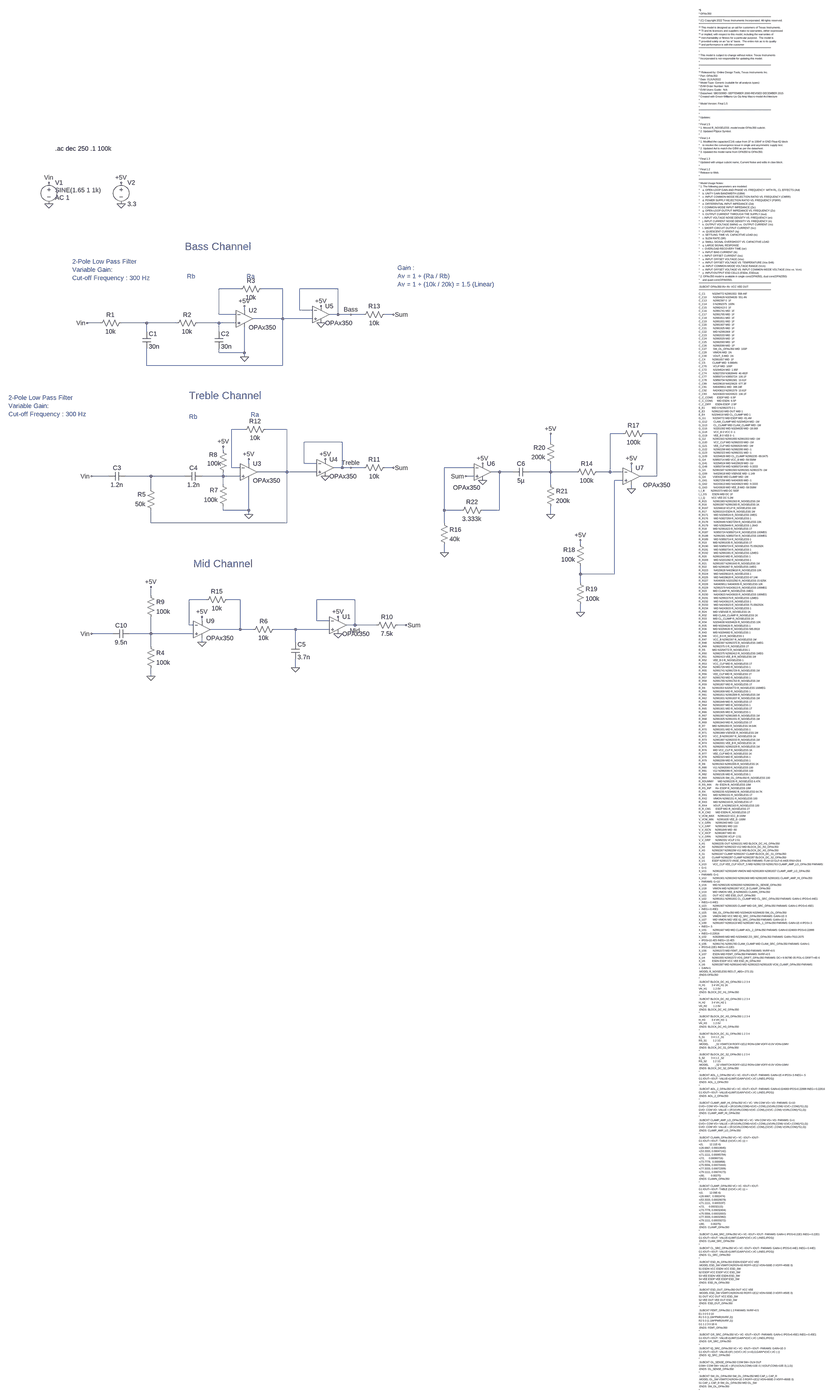
[diagram p0: schematic Filters.asc, whole sheet]
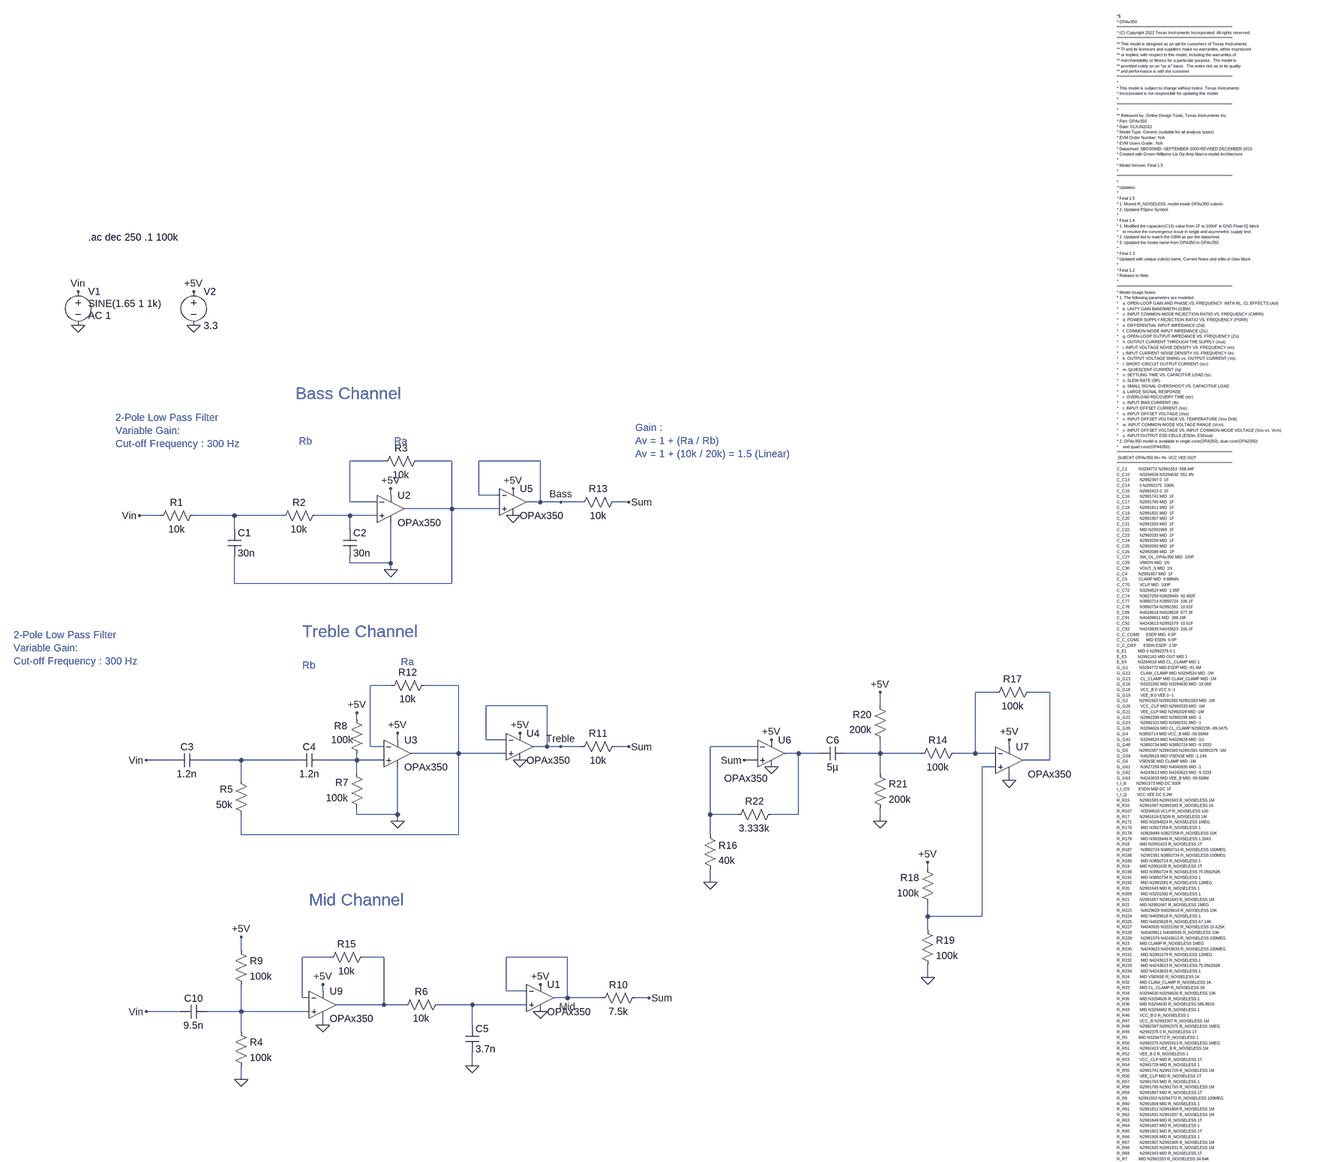
[diagram p1: schematic Filters.asc, part, row 1 of 2, column 1 of 1]
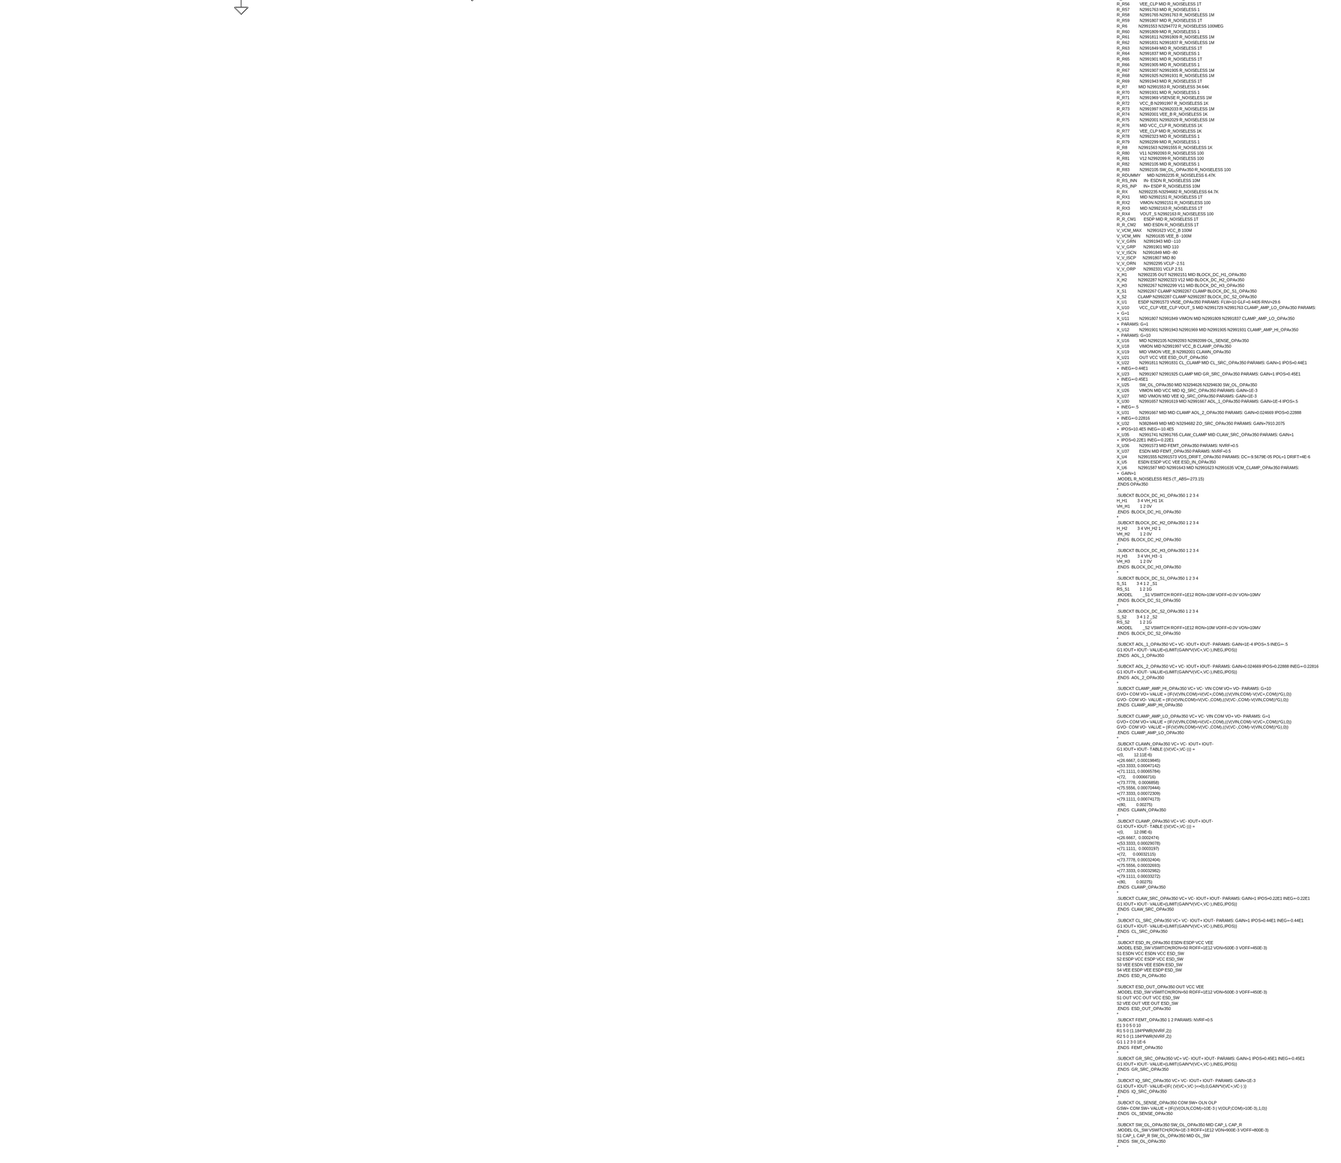
[diagram p2: schematic Filters.asc, part, row 2 of 2, column 1 of 1]
Filters.asc, the LTspice schematic file:
Version 4
SHEET 1 7924 4152
WIRE -640 -528 -720 -528
WIRE -480 -528 -560 -528
WIRE -272 -528 -416 -528
WIRE -624 -448 -624 -464
WIRE -416 -448 -416 -528
WIRE -368 -448 -416 -448
WIRE -720 -432 -720 -528
WIRE -656 -432 -720 -432
WIRE -272 -432 -272 -528
WIRE -272 -432 -304 -432
WIRE -224 -432 -272 -432
WIRE -176 -432 -224 -432
WIRE -64 -432 -96 -432
WIRE -480 -416 -480 -528
WIRE -480 -416 -592 -416
WIRE -368 -416 -480 -416
WIRE -1168 -400 -1216 -400
WIRE -992 -400 -1088 -400
WIRE -880 -400 -992 -400
WIRE -720 -400 -800 -400
WIRE -656 -400 -720 -400
WIRE -992 -368 -992 -400
WIRE -720 -368 -720 -400
WIRE -720 -288 -720 -304
WIRE -624 -288 -624 -384
WIRE -624 -288 -720 -288
WIRE -624 -272 -624 -288
WIRE -992 -240 -992 -304
WIRE -480 -240 -480 -416
WIRE -480 -240 -992 -240
WIRE -624 0 -672 0
WIRE -464 0 -544 0
WIRE 800 16 752 16
WIRE 928 16 880 16
WIRE -256 48 -400 48
WIRE 528 48 528 16
WIRE -704 80 -704 64
WIRE -608 128 -608 112
WIRE -400 128 -400 48
WIRE -352 128 -400 128
WIRE -672 144 -672 0
WIRE -640 144 -672 144
WIRE -256 144 -256 48
WIRE -256 144 -288 144
WIRE -224 144 -256 144
WIRE -176 144 -224 144
WIRE -64 144 -96 144
WIRE 240 144 128 144
WIRE 832 144 832 128
WIRE -464 160 -464 0
WIRE -464 160 -576 160
WIRE -352 160 -464 160
WIRE 336 160 304 160
WIRE 384 160 336 160
WIRE 528 160 528 128
WIRE 528 160 448 160
WIRE 624 160 528 160
WIRE 752 160 752 16
WIRE 752 160 704 160
WIRE 800 160 752 160
WIRE -1136 176 -1200 176
WIRE -976 176 -1072 176
WIRE -848 176 -976 176
WIRE -704 176 -704 160
WIRE -704 176 -784 176
WIRE -640 176 -704 176
WIRE 240 176 208 176
WIRE 928 176 928 16
WIRE 928 176 864 176
WIRE 800 192 768 192
WIRE -704 208 -704 176
WIRE 528 208 528 160
WIRE -976 224 -976 176
WIRE 832 224 832 208
WIRE -704 304 -704 288
WIRE -608 304 -608 192
WIRE -608 304 -704 304
WIRE 128 304 128 144
WIRE 192 304 128 304
WIRE 336 304 336 160
WIRE 336 304 272 304
WIRE -608 320 -608 304
WIRE 528 320 528 288
WIRE -976 352 -976 304
WIRE -464 352 -464 160
WIRE -464 352 -976 352
WIRE 128 352 128 304
WIRE 640 432 640 416
WIRE 128 464 128 432
WIRE 640 544 640 512
WIRE 768 544 768 192
WIRE 768 544 640 544
WIRE 640 576 640 544
WIRE -976 624 -976 592
WIRE -768 640 -832 640
WIRE -640 640 -688 640
WIRE -208 640 -352 640
WIRE 640 688 640 656
WIRE -784 720 -784 704
WIRE -352 720 -352 640
WIRE -304 720 -352 720
WIRE -832 736 -832 640
WIRE -816 736 -832 736
WIRE -208 736 -208 640
WIRE -208 736 -240 736
WIRE -128 736 -208 736
WIRE -16 736 -48 736
WIRE -640 752 -640 640
WIRE -640 752 -752 752
WIRE -592 752 -640 752
WIRE -432 752 -512 752
WIRE -304 752 -432 752
WIRE -1120 768 -1200 768
WIRE -976 768 -976 704
WIRE -976 768 -1056 768
WIRE -816 768 -976 768
WIRE -784 800 -784 784
WIRE -432 800 -432 752
WIRE -976 816 -976 768
WIRE -432 896 -432 864
WIRE -976 928 -976 896
FLAG -1360 -848 0
FLAG -1088 -848 0
FLAG -1360 -928 Vin
FLAG -1088 -928 +5V
FLAG -624 -272 0
FLAG -1216 -400 Vin
FLAG -624 -464 +5V
FLAG -608 320 0
FLAG -1200 176 Vin
FLAG -608 112 +5V
FLAG -704 64 +5V
FLAG -784 800 0
FLAG -1200 768 Vin
FLAG -784 704 +5V
FLAG -976 928 0
FLAG -432 896 0
FLAG -976 592 +5V
FLAG -272 704 +5V
FLAG -272 768 0
FLAG -320 112 +5V
FLAG -320 176 0
FLAG -336 -464 +5V
FLAG -336 -400 0
FLAG -224 -432 Bass
FLAG -224 144 Treble
FLAG -208 736 Mid
FLAG 272 128 +5V
FLAG 272 192 0
FLAG -16 736 Sum
FLAG -64 144 Sum
FLAG -64 -432 Sum
FLAG 208 176 Sum
FLAG 832 128 +5V
FLAG 832 224 0
FLAG 640 416 +5V
FLAG 640 688 0
FLAG 528 320 0
FLAG 528 16 +5V
FLAG 128 464 0
SYMBOL voltage -1360 -944 R0
WINDOW 3 24 44 Left 2
WINDOW 123 24 72 Left 2
WINDOW 39 0 0 Left 0
SYMATTR Value SINE(1.65 1 1k)
SYMATTR Value2 AC 1
SYMATTR InstName V1
SYMBOL voltage -1088 -944 R0
WINDOW 123 0 0 Left 0
WINDOW 39 0 0 Left 0
SYMATTR InstName V2
SYMATTR Value 3.3
SYMBOL OpAmps\\opamp2 -624 -480 R0
SYMATTR InstName U2
SYMATTR Value OPAx350
SYMBOL res -1072 -416 R90
WINDOW 0 0 56 VBottom 2
WINDOW 3 32 56 VTop 2
SYMATTR InstName R1
SYMATTR Value 10k
SYMBOL res -784 -416 R90
WINDOW 0 0 56 VBottom 2
WINDOW 3 32 56 VTop 2
SYMATTR InstName R2
SYMATTR Value 10k
SYMBOL cap -1008 -368 R0
SYMATTR InstName C1
SYMATTR Value 30n
SYMBOL cap -736 -368 R0
SYMATTR InstName C2
SYMATTR Value 30n
SYMBOL res -544 -544 R90
WINDOW 0 0 56 VBottom 2
WINDOW 3 32 56 VTop 2
SYMATTR InstName R3
SYMATTR Value 10k
SYMBOL OpAmps\\opamp2 -608 96 R0
SYMATTR InstName U3
SYMATTR Value OPAx350
SYMBOL res -960 320 R180
WINDOW 0 36 76 Left 2
WINDOW 3 36 40 Left 2
SYMATTR InstName R5
SYMATTR Value 50k
SYMBOL res -688 304 R180
WINDOW 0 36 76 Left 2
WINDOW 3 36 40 Left 2
SYMATTR InstName R7
SYMATTR Value 100k
SYMBOL cap -1072 160 R90
WINDOW 0 0 32 VBottom 2
WINDOW 3 32 32 VTop 2
SYMATTR InstName C3
SYMATTR Value 1.2n
SYMBOL cap -784 160 R90
WINDOW 0 0 32 VBottom 2
WINDOW 3 32 32 VTop 2
SYMATTR InstName C4
SYMATTR Value 1.2n
SYMBOL res -528 -16 R90
WINDOW 0 0 56 VBottom 2
WINDOW 3 32 56 VTop 2
SYMATTR InstName R12
SYMATTR Value 10k
SYMBOL res -720 64 R0
WINDOW 0 -37 31 Left 2
WINDOW 3 -44 63 Left 2
SYMATTR InstName R8
SYMATTR Value 100k
SYMBOL OpAmps\\opamp2 -784 688 R0
SYMATTR InstName U9
SYMATTR Value OPAx350
SYMBOL cap -1056 752 R90
WINDOW 0 0 32 VBottom 2
WINDOW 3 32 32 VTop 2
SYMATTR InstName C10
SYMATTR Value 9.5n
SYMBOL res -992 800 R0
SYMATTR InstName R4
SYMATTR Value 100k
SYMBOL res -496 736 R90
WINDOW 0 0 56 VBottom 2
WINDOW 3 32 56 VTop 2
SYMATTR InstName R6
SYMATTR Value 10k
SYMBOL cap -448 800 R0
SYMATTR InstName C5
SYMATTR Value 3.7n
SYMBOL res -992 608 R0
SYMATTR InstName R9
SYMATTR Value 100k
SYMBOL OpAmps\\opamp2 -272 672 R0
SYMATTR InstName U1
SYMATTR Value OPAx350
SYMBOL OpAmps\\opamp2 -320 80 R0
SYMATTR InstName U4
SYMATTR Value OPAx350
SYMBOL OpAmps\\opamp2 -336 -496 R0
SYMATTR InstName U5
SYMATTR Value OPAx350
SYMBOL OpAmps\\opamp2 272 96 R0
WINDOW 3 -111 122 Left 2
SYMATTR Value OPAx350
SYMATTR InstName U6
SYMBOL res -32 720 R90
WINDOW 0 0 56 VBottom 2
WINDOW 3 32 56 VTop 2
SYMATTR InstName R10
SYMATTR Value 7.5k
SYMBOL res -80 128 R90
WINDOW 0 0 56 VBottom 2
WINDOW 3 32 56 VTop 2
SYMATTR InstName R11
SYMATTR Value 10k
SYMBOL res -80 -448 R90
WINDOW 0 0 56 VBottom 2
WINDOW 3 32 56 VTop 2
SYMATTR InstName R13
SYMATTR Value 10k
SYMBOL res -672 624 R90
WINDOW 0 0 56 VBottom 2
WINDOW 3 32 56 VTop 2
SYMATTR InstName R15
SYMATTR Value 10k
SYMBOL OpAmps\\opamp2 832 112 R0
WINDOW 3 44 97 Left 2
SYMATTR Value OPAx350
SYMATTR InstName U7
SYMBOL res 720 144 R90
WINDOW 0 0 56 VBottom 2
WINDOW 3 32 56 VTop 2
SYMATTR InstName R14
SYMATTR Value 100k
SYMBOL res 896 0 R90
WINDOW 0 0 56 VBottom 2
WINDOW 3 32 56 VTop 2
SYMATTR InstName R17
SYMATTR Value 100k
SYMBOL res 656 528 R180
WINDOW 0 36 76 Left 2
WINDOW 3 36 40 Left 2
SYMATTR InstName R18
SYMATTR Value 100k
SYMBOL res 624 560 R0
SYMATTR InstName R19
SYMATTR Value 100k
SYMBOL cap 448 144 R90
WINDOW 0 0 32 VBottom 2
WINDOW 3 32 32 VTop 2
SYMATTR InstName C6
SYMATTR Value 5µ
SYMBOL res 544 144 R180
WINDOW 0 36 76 Left 2
WINDOW 3 36 40 Left 2
SYMATTR InstName R20
SYMATTR Value 200k
SYMBOL res 512 192 R0
SYMATTR InstName R21
SYMATTR Value 200k
SYMBOL res 288 288 R90
WINDOW 0 0 56 VBottom 2
WINDOW 3 32 56 VTop 2
SYMATTR InstName R22
SYMATTR Value 3.333k
SYMBOL res 112 336 R0
SYMATTR InstName R16
SYMATTR Value 40k
TEXT 7400 -1576 Left 0 !*$\n* OPAx350\n*****************************************************************************\n* (C) Copyright 2022 Texas Instruments Incorporated. All rights reserved.                                            \n*****************************************************************************\n** This model is designed as an aid for customers of Texas Instruments.\n** TI and its licensors and suppliers make no warranties, either expressed\n** or implied, with respect to this model, including the warranties of \n** merchantability or fitness for a particular purpose.  The model is\n** provided solely on an "as is" basis.  The entire risk as to its quality\n** and performance is with the customer\n*****************************************************************************\n*\n* This model is subject to change without notice. Texas Instruments\n* Incorporated is not responsible for updating this model.\n*\n*****************************************************************************\n*\n** Released by: Online Design Tools, Texas Instruments Inc.\n* Part: OPAx350\n* Date: 01JUN2022\n* Model Type: Generic (suitable for all analysis types)\n* EVM Order Number: N/A \n* EVM Users Guide:  N/A \n* Datasheet: SBOS099D -SEPTEMBER 2000-REVISED DECEMBER 2015\n* Created with Green-Williams-Lis Op Amp Macro-model Architecture\n*\n* Model Version: Final 1.5\n*\n*****************************************************************************\n*\n* Updates:\n*\n* Final 1.5\n* 1. Moved R_NOISELESS .model inside OPAx350 subckt.\n* 2. Updated PSpice Symbol.\n*\n* Final 1.4\n* 1. Modified the capacitor(C14) value from 1F to 100nF in GND Float-IQ block  \n*    to resolve the convergence issue in single and asymmetric supply test.\n* 2. Updated Aol to match the GBW as per the datasheet.\n* 3. Updated the model name from OPA350 to OPAx350.\n*\n* Final 1.3\n* Updated with unique subckt name, Current Noise and edits in claw block.\n*\n* Final 1.2 \n* Release to Web.\n*\n*****************************************************************************\n* Model Usage Notes:\n* 1. The following parameters are modeled: \n*    a. OPEN-LOOP GAIN AND PHASE VS. FREQUENCY  WITH RL, CL EFFECTS (Aol)\n*    b. UNITY GAIN BANDWIDTH (GBW)\n*    c. INPUT COMMON-MODE REJECTION RATIO VS. FREQUENCY (CMRR)\n*    d. POWER SUPPLY REJECTION RATIO VS. FREQUENCY (PSRR)\n*    e. DIFFERENTIAL INPUT IMPEDANCE (Zid)\n*    f. COMMON-MODE INPUT IMPEDANCE (Zic)\n*    g. OPEN-LOOP OUTPUT IMPEDANCE VS. FREQUENCY (Zo)\n*    h. OUTPUT CURRENT THROUGH THE SUPPLY (Iout)\n*    i. INPUT VOLTAGE NOISE DENSITY VS. FREQUENCY (en)\n*    j. INPUT CURRENT NOISE DENSITY VS. FREQUENCY (in)\n*    k. OUTPUT VOLTAGE SWING vs. OUTPUT CURRENT (Vo)\n*    l. SHORT-CIRCUIT OUTPUT CURRENT (Isc)\n*    m. QUIESCENT CURRENT (Iq)\n*    n. SETTLING TIME VS. CAPACITIVE LOAD (ts)\n*    o. SLEW RATE (SR)\n*    p. SMALL SIGNAL OVERSHOOT VS. CAPACITIVE LOAD\n*    q. LARGE SIGNAL RESPONSE\n*    r. OVERLOAD RECOVERY TIME (tor)\n*    s. INPUT BIAS CURRENT (Ib)\n*    t. INPUT OFFSET CURRENT (Ios)\n*    u. INPUT OFFSET VOLTAGE (Vos)\n*    v. INPUT OFFSET VOLTAGE VS. TEMPERATURE (Vos Drift)\n*    w. INPUT COMMON-MODE VOLTAGE RANGE (Vcm)\n*    x. INPUT OFFSET VOLTAGE VS. INPUT COMMON-MODE VOLTAGE (Vos vs. Vcm)\n*    y. INPUT/OUTPUT ESD CELLS (ESDin, ESDout) \n* 2. OPAx350 model is available in single core(OPA350), dual core(OPA2350)\n*    and quad core(OPA4350). \n*****************************************************************************\n.SUBCKT OPAx350 IN+ IN- VCC VEE OUT  \n*****************************************************************************\nC_C1          N3294772 N2991553  558.44F   \nC_C10         N3294626 N3294630  551.4N   \nC_C13         N2992397 0  1F   \nC_C14         0 N2992375  100N   \nC_C15         N2992413 0  1F   \nC_C16         N2991741 MID  1F   \nC_C17         N2991765 MID  1F   \nC_C18         N2991811 MID  1F   \nC_C19         N2991831 MID  1F   \nC_C20         N2991907 MID  1F   \nC_C21         N2991925 MID  1F   \nC_C22         MID N2991969  1F   \nC_C23         N2992033 MID  1F   \nC_C24         N2992029 MID  1F   \nC_C25         N2992093 MID  1P   \nC_C26         N2992099 MID  1P   \nC_C27         SW_OL_OPAx350 MID  100P   \nC_C29         VIMON MID  1N   \nC_C30         VOUT_S MID  1N   \nC_C4          N2991657 MID  1F   \nC_C5          CLAMP MID  9.8884N   \nC_C70         VCLP MID  100P   \nC_C72         N3294524 MID  1.95F   \nC_C74         N3827259 N3828449  40.482F   \nC_C77         N3850714 N3850724  106.1F   \nC_C78         N3850734 N2991581  10.61F   \nC_C89         N4029618 N4029628  677.3F   \nC_C91         N40409811 MID  388.18F   \nC_C92         N4243613 N2991579  10.61F   \nC_C93         N4243633 N4243623  106.1F   \nC_C_COM0      ESDP MID  6.5P   \nC_C_COM1      MID ESDN  6.5P   \nC_C_DIFF      ESDN ESDP  2.5P   \nE_E1          MID 0 N2992375 0 1\nE_E3          N2992163 MID OUT MID 1\nE_E4          N3294618 MID CL_CLAMP MID 1\nG_G1          N3294772 MID ESDP MID -81.4M\nG_G12         CLAW_CLAMP MID N3294524 MID -1M\nG_G13         CL_CLAMP MID CLAW_CLAMP MID -1M\nG_G16         N3201092 MID N3294630 MID -18.068\nG_G18         VCC_B 0 VCC 0 -1\nG_G19         VEE_B 0 VEE 0 -1\nG_G2          N2991563 N2991555 N2991553 MID -1M\nG_G20         VCC_CLP MID N2992033 MID -1M\nG_G21         VEE_CLP MID N2992029 MID -1M\nG_G22         N2992299 MID N2992295 MID -1\nG_G23         N2992323 MID N2992331 MID -1\nG_G39         N3294626 MID CL_CLAMP N2992235 -89.0475\nG_G4          N3850714 MID VCC_B MID -59.558M\nG_G41         N3294524 MID N4029628 MID -1U\nG_G48         N3850734 MID N3850724 MID -9.3333\nG_G5          N2991587 N2991583 N2991581 N2991579 -1M\nG_G59         N4029618 MID VSENSE MID -1.149\nG_G6          VSENSE MID CLAMP MID -1M\nG_G61         N3827259 MID N4040935 MID -1\nG_G62         N4243613 MID N4243623 MID -9.3333\nG_G63         N4243633 MID VEE_B MID -59.558M\nI_I_B         N2991573 MID DC 500F  \nI_I_OS        ESDN MID DC 1F  \nI_I_Q         VCC VEE DC 5.2M  \nR_R15         N2991583 N2991563 R_NOISELESS 1M\nR_R16         N2991587 N2991583 R_NOISELESS 1K\nR_R167        N3294618 VCLP R_NOISELESS 100\nR_R17         N2991619 ESDN R_NOISELESS 1M\nR_R171        MID N3294524 R_NOISELESS 1MEG\nR_R176        MID N3827259 R_NOISELESS 1\nR_R178        N3828449 N3827259 R_NOISELESS 10K\nR_R179        MID N3828449 R_NOISELESS 1.2643\nR_R18         MID N2991623 R_NOISELESS 1T\nR_R187        N3850724 N3850714 R_NOISELESS 100MEG\nR_R188        N2991581 N3850734 R_NOISELESS 100MEG\nR_R189        MID N3850714 R_NOISELESS 1\nR_R19         MID N2991635 R_NOISELESS 1T\nR_R190        MID N3850724 R_NOISELESS 75.056292K\nR_R191        MID N3850734 R_NOISELESS 1\nR_R192        MID N2991581 R_NOISELESS 12MEG\nR_R20         N2991643 MID R_NOISELESS 1\nR_R209        MID N3201092 R_NOISELESS 1\nR_R21         N2991657 N2991643 R_NOISELESS 1M\nR_R22         MID N2991667 R_NOISELESS 1MEG\nR_R223        N4029628 N4029618 R_NOISELESS 10K\nR_R224        MID N4029618 R_NOISELESS 1\nR_R225        MID N4029628 R_NOISELESS 67.14K\nR_R227        N4040935 N3201092 R_NOISELESS 15.625K\nR_R228        N40409811 N4040935 R_NOISELESS 10K\nR_R229        N2991579 N4243613 R_NOISELESS 100MEG\nR_R23         MID CLAMP R_NOISELESS 1MEG\nR_R230        N4243623 N4243633 R_NOISELESS 100MEG\nR_R231        MID N2991579 R_NOISELESS 12MEG\nR_R232        MID N4243613 R_NOISELESS 1\nR_R233        MID N4243623 R_NOISELESS 75.056292K\nR_R234        MID N4243633 R_NOISELESS 1\nR_R24         MID VSENSE R_NOISELESS 1K\nR_R32         MID CLAW_CLAMP R_NOISELESS 1K\nR_R33         MID CL_CLAMP R_NOISELESS 1K\nR_R34         N3294630 N3294626 R_NOISELESS 10K\nR_R35         MID N3294626 R_NOISELESS 1\nR_R36         MID N3294630 R_NOISELESS 585.8918\nR_R43         MID N3294682 R_NOISELESS 1\nR_R46         VCC_B 0 R_NOISELESS 1\nR_R47         VCC_B N2992397 R_NOISELESS 1M\nR_R48         N2992397 N2992375 R_NOISELESS 1MEG\nR_R49         N2992375 0 R_NOISELESS 1T\nR_R5          MID N3294772 R_NOISELESS 1\nR_R50         N2992375 N2992413 R_NOISELESS 1MEG\nR_R51         N2992413 VEE_B R_NOISELESS 1M\nR_R52         VEE_B 0 R_NOISELESS 1\nR_R53         VCC_CLP MID R_NOISELESS 1T\nR_R54         N2991729 MID R_NOISELESS 1\nR_R55         N2991741 N2991729 R_NOISELESS 1M\nR_R56         VEE_CLP MID R_NOISELESS 1T\nR_R57         N2991763 MID R_NOISELESS 1\nR_R58         N2991765 N2991763 R_NOISELESS 1M\nR_R59         N2991807 MID R_NOISELESS 1T\nR_R6          N2991553 N3294772 R_NOISELESS 100MEG\nR_R60         N2991809 MID R_NOISELESS 1\nR_R61         N2991811 N2991809 R_NOISELESS 1M\nR_R62         N2991831 N2991837 R_NOISELESS 1M\nR_R63         N2991849 MID R_NOISELESS 1T\nR_R64         N2991837 MID R_NOISELESS 1\nR_R65         N2991901 MID R_NOISELESS 1T\nR_R66         N2991905 MID R_NOISELESS 1\nR_R67         N2991907 N2991905 R_NOISELESS 1M\nR_R68         N2991925 N2991931 R_NOISELESS 1M\nR_R69         N2991943 MID R_NOISELESS 1T\nR_R7          MID N2991553 R_NOISELESS 34.64K\nR_R70         N2991931 MID R_NOISELESS 1\nR_R71         N2991969 VSENSE R_NOISELESS 1M\nR_R72         VCC_B N2991997 R_NOISELESS 1K\nR_R73         N2991997 N2992033 R_NOISELESS 1M\nR_R74         N2992001 VEE_B R_NOISELESS 1K\nR_R75         N2992001 N2992029 R_NOISELESS 1M\nR_R76         MID VCC_CLP R_NOISELESS 1K\nR_R77         VEE_CLP MID R_NOISELESS 1K\nR_R78         N2992323 MID R_NOISELESS 1\nR_R79         N2992299 MID R_NOISELESS 1\nR_R8          N2991563 N2991555 R_NOISELESS 1K\nR_R80         V11 N2992093 R_NOISELESS 100\nR_R81         V12 N2992099 R_NOISELESS 100\nR_R82         N2992105 MID R_NOISELESS 1\nR_R83         N2992105 SW_OL_OPAx350 R_NOISELESS 100\nR_RDUMMY      MID N2992235 R_NOISELESS 6.47K\nR_RS_INN      IN- ESDN R_NOISELESS 10M\nR_RS_INP      IN+ ESDP R_NOISELESS 10M\nR_RX          N2992235 N3294682 R_NOISELESS 64.7K\nR_RX1         MID N2992151 R_NOISELESS 1T\nR_RX2         VIMON N2992151 R_NOISELESS 100\nR_RX3         MID N2992163 R_NOISELESS 1T\nR_RX4         VOUT_S N2992163 R_NOISELESS 100\nR_R_CM1       ESDP MID R_NOISELESS 1T\nR_R_CM2       MID ESDN R_NOISELESS 1T\nV_VCM_MAX     N2991623 VCC_B 100M\nV_VCM_MIN     N2991635 VEE_B -100M\nV_V_GRN       N2991943 MID -110\nV_V_GRP       N2991901 MID 110\nV_V_ISCN      N2991849 MID -80\nV_V_ISCP      N2991807 MID 80\nV_V_ORN       N2992295 VCLP -2.51\nV_V_ORP       N2992331 VCLP 2.51\nX_H1          N2992235 OUT N2992151 MID BLOCK_DC_H1_OPAx350 \nX_H2          N2992287 N2992323 V12 MID BLOCK_DC_H2_OPAx350 \nX_H3          N2992267 N2992299 V11 MID BLOCK_DC_H3_OPAx350 \nX_S1          N2992267 CLAMP N2992267 CLAMP BLOCK_DC_S1_OPAx350 \nX_S2          CLAMP N2992287 CLAMP N2992287 BLOCK_DC_S2_OPAx350 \nX_U1          ESDP N2991573 VNSE_OPAx350 PARAMS: FLW=10 GLF=0.4405 RNV=29.6\nX_U10         VCC_CLP VEE_CLP VOUT_S MID N2991729 N2991763 CLAMP_AMP_LO_OPAx350 PARAMS:\n+  G=1\nX_U11         N2991807 N2991849 VIMON MID N2991809 N2991837 CLAMP_AMP_LO_OPAx350\n+  PARAMS: G=1\nX_U12         N2991901 N2991943 N2991969 MID N2991905 N2991931 CLAMP_AMP_HI_OPAx350\n+  PARAMS: G=10\nX_U16         MID N2992105 N2992093 N2992099 OL_SENSE_OPAx350\nX_U18         VIMON MID N2991997 VCC_B CLAWP_OPAx350\nX_U19         MID VIMON VEE_B N2992001 CLAWN_OPAx350\nX_U21         OUT VCC VEE ESD_OUT_OPAx350\nX_U22         N2991811 N2991831 CL_CLAMP MID CL_SRC_OPAx350 PARAMS: GAIN=1 IPOS=0.44E1\n+  INEG=-0.44E1\nX_U23         N2991907 N2991925 CLAMP MID GR_SRC_OPAx350 PARAMS: GAIN=1 IPOS=0.45E1\n+  INEG=-0.45E1\nX_U25         SW_OL_OPAx350 MID N3294626 N3294630 SW_OL_OPAx350\nX_U26         VIMON MID VCC MID IQ_SRC_OPAx350 PARAMS: GAIN=1E-3\nX_U27         MID VIMON MID VEE IQ_SRC_OPAx350 PARAMS: GAIN=1E-3\nX_U30         N2991657 N2991619 MID N2991667 AOL_1_OPAx350 PARAMS: GAIN=1E-4 IPOS=.5\n+  INEG=-.5\nX_U31         N2991667 MID MID CLAMP AOL_2_OPAx350 PARAMS: GAIN=0.024669 IPOS=0.22888\n+  INEG=-0.22816\nX_U32         N3828449 MID MID N3294682 ZO_SRC_OPAx350 PARAMS: GAIN=7910.2075\n+  IPOS=10.4E5 INEG=-10.4E5\nX_U35         N2991741 N2991765 CLAW_CLAMP MID CLAW_SRC_OPAx350 PARAMS: GAIN=1\n+  IPOS=0.22E1 INEG=-0.22E1\nX_U36         N2991573 MID FEMT_OPAx350 PARAMS: NVRF=0.5\nX_U37         ESDN MID FEMT_OPAx350 PARAMS: NVRF=0.5\nX_U4          N2991555 N2991573 VOS_DRIFT_OPAx350 PARAMS: DC=-9.5679E-05 POL=1 DRIFT=4E-6\nX_U5          ESDN ESDP VCC VEE ESD_IN_OPAx350\nX_U6          N2991587 MID N2991643 MID N2991623 N2991635 VCM_CLAMP_OPAx350 PARAMS:\n+  GAIN=1\n.MODEL R_NOISELESS RES (T_ABS=-273.15)\n.ENDS OPAx350\n*\n.SUBCKT BLOCK_DC_H1_OPAx350 1 2 3 4  \nH_H1         3 4 VH_H1 1K\nVH_H1         1 2 0V\n.ENDS  BLOCK_DC_H1_OPAx350\n*\n.SUBCKT BLOCK_DC_H2_OPAx350 1 2 3 4  \nH_H2         3 4 VH_H2 1\nVH_H2         1 2 0V\n.ENDS  BLOCK_DC_H2_OPAx350\n*\n.SUBCKT BLOCK_DC_H3_OPAx350 1 2 3 4  \nH_H3         3 4 VH_H3 -1\nVH_H3         1 2 0V\n.ENDS  BLOCK_DC_H3_OPAx350\n*\n.SUBCKT BLOCK_DC_S1_OPAx350 1 2 3 4  \nS_S1         3 4 1 2 _S1\nRS_S1         1 2 1G\n.MODEL         _S1 VSWITCH ROFF=1E12 RON=10M VOFF=0.0V VON=10MV\n.ENDS  BLOCK_DC_S1_OPAx350\n*\n.SUBCKT BLOCK_DC_S2_OPAx350 1 2 3 4  \nS_S2         3 4 1 2 _S2\nRS_S2         1 2 1G\n.MODEL         _S2 VSWITCH ROFF=1E12 RON=10M VOFF=0.0V VON=10MV\n.ENDS  BLOCK_DC_S2_OPAx350\n*\n.SUBCKT AOL_1_OPAx350 VC+ VC- IOUT+ IOUT- PARAMS: GAIN=1E-4 IPOS=.5 INEG=-.5\nG1 IOUT+ IOUT- VALUE={LIMIT(GAIN*V(VC+,VC-),INEG,IPOS)}\n.ENDS  AOL_1_OPAx350\n*\n.SUBCKT AOL_2_OPAx350 VC+ VC- IOUT+ IOUT- PARAMS: GAIN=0.024669 IPOS=0.22888 INEG=-0.22816\nG1 IOUT+ IOUT- VALUE={LIMIT(GAIN*V(VC+,VC-),INEG,IPOS)}\n.ENDS  AOL_2_OPAx350\n*\n.SUBCKT CLAMP_AMP_HI_OPAx350 VC+ VC- VIN COM VO+ VO- PARAMS: G=10\nGVO+ COM VO+ VALUE = {IF(V(VIN,COM)>V(VC+,COM),((V(VIN,COM)-V(VC+,COM))*G),0)}\nGVO- COM VO- VALUE = {IF(V(VIN,COM)<V(VC-,COM),((V(VC-,COM)-V(VIN,COM))*G),0)}\n.ENDS  CLAMP_AMP_HI_OPAx350\n*\n.SUBCKT CLAMP_AMP_LO_OPAx350 VC+ VC- VIN COM VO+ VO- PARAMS: G=1\nGVO+ COM VO+ VALUE = {IF(V(VIN,COM)>V(VC+,COM),((V(VIN,COM)-V(VC+,COM))*G),0)}\nGVO- COM VO- VALUE = {IF(V(VIN,COM)<V(VC-,COM),((V(VC-,COM)-V(VIN,COM))*G),0)}\n.ENDS  CLAMP_AMP_LO_OPAx350\n*\n.SUBCKT CLAWN_OPAx350 VC+ VC- IOUT+ IOUT-\nG1 IOUT+ IOUT- TABLE {(V(VC+,VC-))} =\n+(0,         12.11E-6)\n+(26.6667, 0.00019845)\n+(53.3333, 0.00047142)\n+(71.1111, 0.00065784)\n+(72,      0.00066716)\n+(73.7778,  0.0006858)\n+(75.5556, 0.00070444)\n+(77.3333, 0.00072309)\n+(79.1111, 0.00074173)\n+(80,         0.00275)\n.ENDS  CLAWN_OPAx350\n*\n.SUBCKT CLAWP_OPAx350 VC+ VC- IOUT+ IOUT-\nG1 IOUT+ IOUT- TABLE {(V(VC+,VC-))} =\n+(0,         12.09E-6)\n+(26.6667,  0.0002474)\n+(53.3333, 0.00029078)\n+(71.1111,  0.0003197)\n+(72,      0.00032115)\n+(73.7778, 0.00032404)\n+(75.5556, 0.00032693)\n+(77.3333, 0.00032982)\n+(79.1111, 0.00033272)\n+(80,         0.00275)\n.ENDS  CLAWP_OPAx350\n*\n.SUBCKT CLAW_SRC_OPAx350 VC+ VC- IOUT+ IOUT- PARAMS: GAIN=1 IPOS=0.22E1 INEG=-0.22E1\nG1 IOUT+ IOUT- VALUE={LIMIT(GAIN*V(VC+,VC-),INEG,IPOS)}\n.ENDS  CLAW_SRC_OPAx350\n*\n.SUBCKT CL_SRC_OPAx350 VC+ VC- IOUT+ IOUT- PARAMS: GAIN=1 IPOS=0.44E1 INEG=-0.44E1\nG1 IOUT+ IOUT- VALUE={LIMIT(GAIN*V(VC+,VC-),INEG,IPOS)}\n.ENDS  CL_SRC_OPAx350\n*\n.SUBCKT ESD_IN_OPAx350 ESDN ESDP VCC VEE\n.MODEL ESD_SW VSWITCH(RON=50 ROFF=1E12 VON=500E-3 VOFF=450E-3)\nS1 ESDN VCC ESDN VCC ESD_SW\nS2 ESDP VCC ESDP VCC ESD_SW\nS3 VEE ESDN VEE ESDN ESD_SW\nS4 VEE ESDP VEE ESDP ESD_SW\n.ENDS  ESD_IN_OPAx350\n*\n.SUBCKT ESD_OUT_OPAx350 OUT VCC VEE\n.MODEL ESD_SW VSWITCH(RON=50 ROFF=1E12 VON=500E-3 VOFF=450E-3)\nS1 OUT VCC OUT VCC ESD_SW\nS2 VEE OUT VEE OUT ESD_SW\n.ENDS  ESD_OUT_OPAx350\n*\n.SUBCKT FEMT_OPAx350 1 2 PARAMS: NVRF=0.5\nE1 3 0 5 0 10\nR1 5 0 {1.184*PWR(NVRF,2)}\nR2 5 0 {1.184*PWR(NVRF,2)}\nG1 1 2 3 0 1E-6\n.ENDS  FEMT_OPAx350\n*\n.SUBCKT GR_SRC_OPAx350 VC+ VC- IOUT+ IOUT- PARAMS: GAIN=1 IPOS=0.45E1 INEG=-0.45E1\nG1 IOUT+ IOUT- VALUE={LIMIT(GAIN*V(VC+,VC-),INEG,IPOS)}\n.ENDS  GR_SRC_OPAx350\n*\n.SUBCKT IQ_SRC_OPAx350 VC+ VC- IOUT+ IOUT- PARAMS: GAIN=1E-3\nG1 IOUT+ IOUT- VALUE={IF( (V(VC+,VC-)<=0),0,GAIN*V(VC+,VC-) )}\n.ENDS  IQ_SRC_OPAx350\n*\n.SUBCKT OL_SENSE_OPAx350 COM SW+ OLN OLP\nGSW+ COM SW+ VALUE = {IF((V(OLN,COM)>10E-3 | V(OLP,COM)>10E-3),1,0)}\n.ENDS  OL_SENSE_OPAx350\n*\n.SUBCKT SW_OL_OPAx350 SW_OL_OPAx350 MID CAP_L CAP_R\n.MODEL OL_SW VSWITCH(RON=1E-3 ROFF=1E12 VON=900E-3 VOFF=800E-3)\nS1 CAP_L CAP_R SW_OL_OPAx350 MID OL_SW\n.ENDS  SW_OL_OPAx350\n*\n.SUBCKT VCM_CLAMP_OPAx350 VIN+ VIN- IOUT- IOUT+ VP+ VP- PARAMS: GAIN=1\nG1 IOUT+ IOUT- VALUE={LIMIT(GAIN*V(VIN+,VIN-),V(VP-,VIN-), V(VP+,VIN-))}\n.ENDS  VCM_CLAMP_OPAx350\n*\n.SUBCKT VNSE_OPAx350 1 2 PARAMS: FLW=10 GLF=0.4405 RNV=29.6\n.MODEL DVN D KF={PWR(FLW,0.5)/1E11} IS=1.0E-16\nI1 0 7 10E-3\nI2 0 8 10E-3\nD1 7 0 DVN\nD2 8 0 DVN\nE1 3 6 7 8 {GLF}\nR1 3 0 1E9\nR2 3 0 1E9\nR3 3 6 1E9\nE2 6 4 5 0 10\nR4 5 0 {RNV}\nR5 5 0 {RNV}\nR6 3 4 1E9\nR7 4 0 1E9\nE3 1 2 3 4 1\n.ENDS  VNSE_OPAx350\n*\n.SUBCKT VOS_DRIFT_OPAx350 VOS+ VOS- PARAMS: DC=-9.5679E-05 POL=1 DRIFT=4E-6\nE1 VOS+ VOS- VALUE={DC+POL*DRIFT*(TEMP-27)}\n.ENDS  VOS_DRIFT_OPAx350\n*\n.SUBCKT ZO_SRC_OPAx350 VC+ VC- IOUT+ IOUT- PARAMS: GAIN=7910.2075 IPOS=10.4E5 INEG=-10.4E5\nG1 IOUT+ IOUT- VALUE={LIMIT(GAIN*V(VC+,VC-),INEG,IPOS)}\n.ENDS  ZO_SRC_OPAx350\n*
TEXT -1336 -1056 Left 2 !.ac dec 250 .1 100k
TEXT -848 -688 Left 4 ;Bass Channel
TEXT -1272 -632 Left 2 ;2-Pole Low Pass Filter\nVariable Gain:\nCut-off Frequency : 300 Hz
TEXT -616 -576 Left 2 ;Ra
TEXT -840 -576 Left 2 ;Rb
TEXT -48 -608 Left 2 ;Gain :\nAv = 1 + (Ra / Rb)\nAv = 1 + (10k / 20k) = 1.5 (Linear)
TEXT -832 -128 Left 4 ;Treble Channel
TEXT -1512 -120 Left 2 ;2-Pole Low Pass Filter\nVariable Gain:\nCut-off Frequency : 300 Hz
TEXT -600 -56 Left 2 ;Ra
TEXT -832 -48 Left 2 ;Rb
TEXT -816 504 Left 4 ;Mid Channel

The netlist it stands for:
* Filters.asc
V1 Vin 0 SINE(1.65 1 1k) AC 1
V2 +5V 0 3.3
XU2 N004 N001 +5V 0 N002 OPAx350  ; pins In+ In- V+ V- OUT
R1 N003 Vin 10k
R2 N004 N003 10k
C1 N003 N002 30n
C2 N004 0 30n
R3 N002 N001 10k
XU3 N013 N005 +5V 0 N006 OPAx350  ; pins In+ In- V+ V- OUT
R5 N006 N012 50k
R7 0 N013 100k
C3 N012 Vin 1.2n
C4 N013 N012 1.2n
R12 N006 N005 10k
R8 +5V N013 100k
XU9 N018 N015 +5V 0 N016 OPAx350  ; pins In+ In- V+ V- OUT
C10 N018 Vin 9.5n
R4 N018 0 100k
R6 N017 N016 10k
C5 N017 0 3.7n
R9 +5V N018 100k
XU1 N017 Mid +5V 0 Mid OPAx350  ; pins In+ In- V+ V- OUT
XU4 N006 Treble +5V 0 Treble OPAx350  ; pins In+ In- V+ V- OUT
XU5 N002 Bass +5V 0 Bass OPAx350  ; pins In+ In- V+ V- OUT
XU6 Sum N009 +5V 0 N010 OPAx350  ; pins In+ In- V+ V- OUT
R10 Sum Mid 7.5k
R11 Sum Treble 10k
R13 Sum Bass 10k
R15 N016 N015 10k
XU7 N014 N007 +5V 0 N008 OPAx350  ; pins In+ In- V+ V- OUT
R14 N007 N011 100k
R17 N008 N007 100k
R18 N014 +5V 100k
R19 N014 0 100k
C6 N011 N010 5µ
R20 N011 +5V 200k
R21 N011 0 200k
R22 N010 N009 3.333k
R16 N009 0 40k
*$
* OPAx350
*****************************************************************************
* (C) Copyright 2022 Texas Instruments Incorporated. All rights reserved.
*****************************************************************************
** This model is designed as an aid for customers of Texas Instruments.
** TI and its licensors and suppliers make no warranties, either expressed
** or implied, with respect to this model, including the warranties of
** merchantability or fitness for a particular purpose.  The model is
** provided solely on an "as is" basis.  The entire risk as to its quality
** and performance is with the customer
*****************************************************************************
*
* This model is subject to change without notice. Texas Instruments
* Incorporated is not responsible for updating this model.
*
*****************************************************************************
*
** Released by: Online Design Tools, Texas Instruments Inc.
* Part: OPAx350
* Date: 01JUN2022
* Model Type: Generic (suitable for all analysis types)
* EVM Order Number: N/A
* EVM Users Guide:  N/A
* Datasheet: SBOS099D -SEPTEMBER 2000-REVISED DECEMBER 2015
* Created with Green-Williams-Lis Op Amp Macro-model Architecture
*
* Model Version: Final 1.5
*
*****************************************************************************
*
* Updates:
*
* Final 1.5
* 1. Moved R_NOISELESS .model inside OPAx350 subckt.
* 2. Updated PSpice Symbol.
*
* Final 1.4
* 1. Modified the capacitor(C14) value from 1F to 100nF in GND Float-IQ block
*    to resolve the convergence issue in single and asymmetric supply test.
* 2. Updated Aol to match the GBW as per the datasheet.
* 3. Updated the model name from OPA350 to OPAx350.
*
* Final 1.3
* Updated with unique subckt name, Current Noise and edits in claw block.
*
* Final 1.2
* Release to Web.
*
*****************************************************************************
* Model Usage Notes:
* 1. The following parameters are modeled:
*    a. OPEN-LOOP GAIN AND PHASE VS. FREQUENCY  WITH RL, CL EFFECTS (Aol)
*    b. UNITY GAIN BANDWIDTH (GBW)
*    c. INPUT COMMON-MODE REJECTION RATIO VS. FREQUENCY (CMRR)
*    d. POWER SUPPLY REJECTION RATIO VS. FREQUENCY (PSRR)
*    e. DIFFERENTIAL INPUT IMPEDANCE (Zid)
*    f. COMMON-MODE INPUT IMPEDANCE (Zic)
*    g. OPEN-LOOP OUTPUT IMPEDANCE VS. FREQUENCY (Zo)
*    h. OUTPUT CURRENT THROUGH THE SUPPLY (Iout)
*    i. INPUT VOLTAGE NOISE DENSITY VS. FREQUENCY (en)
*    j. INPUT CURRENT NOISE DENSITY VS. FREQUENCY (in)
*    k. OUTPUT VOLTAGE SWING vs. OUTPUT CURRENT (Vo)
*    l. SHORT-CIRCUIT OUTPUT CURRENT (Isc)
*    m. QUIESCENT CURRENT (Iq)
*    n. SETTLING TIME VS. CAPACITIVE LOAD (ts)
*    o. SLEW RATE (SR)
*    p. SMALL SIGNAL OVERSHOOT VS. CAPACITIVE LOAD
*    q. LARGE SIGNAL RESPONSE
*    r. OVERLOAD RECOVERY TIME (tor)
*    s. INPUT BIAS CURRENT (Ib)
*    t. INPUT OFFSET CURRENT (Ios)
*    u. INPUT OFFSET VOLTAGE (Vos)
*    v. INPUT OFFSET VOLTAGE VS. TEMPERATURE (Vos Drift)
*    w. INPUT COMMON-MODE VOLTAGE RANGE (Vcm)
*    x. INPUT OFFSET VOLTAGE VS. INPUT COMMON-MODE VOLTAGE (Vos vs. Vcm)
*    y. INPUT/OUTPUT ESD CELLS (ESDin, ESDout)
* 2. OPAx350 model is available in single core(OPA350), dual core(OPA2350)
*    and quad core(OPA4350).
*****************************************************************************
.SUBCKT OPAx350 IN+ IN- VCC VEE OUT
*****************************************************************************
C_C1          N3294772 N2991553  558.44F
C_C10         N3294626 N3294630  551.4N
C_C13         N2992397 0  1F
C_C14         0 N2992375  100N
C_C15         N2992413 0  1F
C_C16         N2991741 MID  1F
C_C17         N2991765 MID  1F
C_C18         N2991811 MID  1F
C_C19         N2991831 MID  1F
C_C20         N2991907 MID  1F
C_C21         N2991925 MID  1F
C_C22         MID N2991969  1F
C_C23         N2992033 MID  1F
C_C24         N2992029 MID  1F
C_C25         N2992093 MID  1P
C_C26         N2992099 MID  1P
C_C27         SW_OL_OPAx350 MID  100P
C_C29         VIMON MID  1N
C_C30         VOUT_S MID  1N
C_C4          N2991657 MID  1F
C_C5          CLAMP MID  9.8884N
C_C70         VCLP MID  100P
C_C72         N3294524 MID  1.95F
C_C74         N3827259 N3828449  40.482F
C_C77         N3850714 N3850724  106.1F
C_C78         N3850734 N2991581  10.61F
C_C89         N4029618 N4029628  677.3F
C_C91         N40409811 MID  388.18F
C_C92         N4243613 N2991579  10.61F
C_C93         N4243633 N4243623  106.1F
C_C_COM0      ESDP MID  6.5P
C_C_COM1      MID ESDN  6.5P
C_C_DIFF      ESDN ESDP  2.5P
E_E1          MID 0 N2992375 0 1
E_E3          N2992163 MID OUT MID 1
E_E4          N3294618 MID CL_CLAMP MID 1
G_G1          N3294772 MID ESDP MID -81.4M
G_G12         CLAW_CLAMP MID N3294524 MID -1M
G_G13         CL_CLAMP MID CLAW_CLAMP MID -1M
G_G16         N3201092 MID N3294630 MID -18.068
G_G18         VCC_B 0 VCC 0 -1
G_G19         VEE_B 0 VEE 0 -1
G_G2          N2991563 N2991555 N2991553 MID -1M
G_G20         VCC_CLP MID N2992033 MID -1M
G_G21         VEE_CLP MID N2992029 MID -1M
G_G22         N2992299 MID N2992295 MID -1
G_G23         N2992323 MID N2992331 MID -1
G_G39         N3294626 MID CL_CLAMP N2992235 -89.0475
G_G4          N3850714 MID VCC_B MID -59.558M
G_G41         N3294524 MID N4029628 MID -1U
G_G48         N3850734 MID N3850724 MID -9.3333
G_G5          N2991587 N2991583 N2991581 N2991579 -1M
G_G59         N4029618 MID VSENSE MID -1.149
G_G6          VSENSE MID CLAMP MID -1M
G_G61         N3827259 MID N4040935 MID -1
G_G62         N4243613 MID N4243623 MID -9.3333
G_G63         N4243633 MID VEE_B MID -59.558M
I_I_B         N2991573 MID DC 500F
I_I_OS        ESDN MID DC 1F
I_I_Q         VCC VEE DC 5.2M
R_R15         N2991583 N2991563 R_NOISELESS 1M
R_R16         N2991587 N2991583 R_NOISELESS 1K
R_R167        N3294618 VCLP R_NOISELESS 100
R_R17         N2991619 ESDN R_NOISELESS 1M
R_R171        MID N3294524 R_NOISELESS 1MEG
R_R176        MID N3827259 R_NOISELESS 1
R_R178        N3828449 N3827259 R_NOISELESS 10K
R_R179        MID N3828449 R_NOISELESS 1.2643
R_R18         MID N2991623 R_NOISELESS 1T
R_R187        N3850724 N3850714 R_NOISELESS 100MEG
R_R188        N2991581 N3850734 R_NOISELESS 100MEG
R_R189        MID N3850714 R_NOISELESS 1
R_R19         MID N2991635 R_NOISELESS 1T
R_R190        MID N3850724 R_NOISELESS 75.056292K
R_R191        MID N3850734 R_NOISELESS 1
R_R192        MID N2991581 R_NOISELESS 12MEG
R_R20         N2991643 MID R_NOISELESS 1
R_R209        MID N3201092 R_NOISELESS 1
R_R21         N2991657 N2991643 R_NOISELESS 1M
R_R22         MID N2991667 R_NOISELESS 1MEG
R_R223        N4029628 N4029618 R_NOISELESS 10K
R_R224        MID N4029618 R_NOISELESS 1
R_R225        MID N4029628 R_NOISELESS 67.14K
R_R227        N4040935 N3201092 R_NOISELESS 15.625K
R_R228        N40409811 N4040935 R_NOISELESS 10K
R_R229        N2991579 N4243613 R_NOISELESS 100MEG
R_R23         MID CLAMP R_NOISELESS 1MEG
R_R230        N4243623 N4243633 R_NOISELESS 100MEG
R_R231        MID N2991579 R_NOISELESS 12MEG
R_R232        MID N4243613 R_NOISELESS 1
R_R233        MID N4243623 R_NOISELESS 75.056292K
R_R234        MID N4243633 R_NOISELESS 1
R_R24         MID VSENSE R_NOISELESS 1K
R_R32         MID CLAW_CLAMP R_NOISELESS 1K
R_R33         MID CL_CLAMP R_NOISELESS 1K
R_R34         N3294630 N3294626 R_NOISELESS 10K
R_R35         MID N3294626 R_NOISELESS 1
R_R36         MID N3294630 R_NOISELESS 585.8918
R_R43         MID N3294682 R_NOISELESS 1
R_R46         VCC_B 0 R_NOISELESS 1
R_R47         VCC_B N2992397 R_NOISELESS 1M
R_R48         N2992397 N2992375 R_NOISELESS 1MEG
R_R49         N2992375 0 R_NOISELESS 1T
R_R5          MID N3294772 R_NOISELESS 1
R_R50         N2992375 N2992413 R_NOISELESS 1MEG
R_R51         N2992413 VEE_B R_NOISELESS 1M
R_R52         VEE_B 0 R_NOISELESS 1
R_R53         VCC_CLP MID R_NOISELESS 1T
R_R54         N2991729 MID R_NOISELESS 1
R_R55         N2991741 N2991729 R_NOISELESS 1M
R_R56         VEE_CLP MID R_NOISELESS 1T
R_R57         N2991763 MID R_NOISELESS 1
R_R58         N2991765 N2991763 R_NOISELESS 1M
R_R59         N2991807 MID R_NOISELESS 1T
R_R6          N2991553 N3294772 R_NOISELESS 100MEG
R_R60         N2991809 MID R_NOISELESS 1
R_R61         N2991811 N2991809 R_NOISELESS 1M
R_R62         N2991831 N2991837 R_NOISELESS 1M
R_R63         N2991849 MID R_NOISELESS 1T
R_R64         N2991837 MID R_NOISELESS 1
R_R65         N2991901 MID R_NOISELESS 1T
R_R66         N2991905 MID R_NOISELESS 1
R_R67         N2991907 N2991905 R_NOISELESS 1M
R_R68         N2991925 N2991931 R_NOISELESS 1M
R_R69         N2991943 MID R_NOISELESS 1T
R_R7          MID N2991553 R_NOISELESS 34.64K
R_R70         N2991931 MID R_NOISELESS 1
R_R71         N2991969 VSENSE R_NOISELESS 1M
R_R72         VCC_B N2991997 R_NOISELESS 1K
R_R73         N2991997 N2992033 R_NOISELESS 1M
R_R74         N2992001 VEE_B R_NOISELESS 1K
R_R75         N2992001 N2992029 R_NOISELESS 1M
R_R76         MID VCC_CLP R_NOISELESS 1K
R_R77         VEE_CLP MID R_NOISELESS 1K
R_R78         N2992323 MID R_NOISELESS 1
R_R79         N2992299 MID R_NOISELESS 1
R_R8          N2991563 N2991555 R_NOISELESS 1K
R_R80         V11 N2992093 R_NOISELESS 100
R_R81         V12 N2992099 R_NOISELESS 100
R_R82         N2992105 MID R_NOISELESS 1
R_R83         N2992105 SW_OL_OPAx350 R_NOISELESS 100
R_RDUMMY      MID N2992235 R_NOISELESS 6.47K
R_RS_INN      IN- ESDN R_NOISELESS 10M
R_RS_INP      IN+ ESDP R_NOISELESS 10M
R_RX          N2992235 N3294682 R_NOISELESS 64.7K
R_RX1         MID N2992151 R_NOISELESS 1T
R_RX2         VIMON N2992151 R_NOISELESS 100
R_RX3         MID N2992163 R_NOISELESS 1T
R_RX4         VOUT_S N2992163 R_NOISELESS 100
R_R_CM1       ESDP MID R_NOISELESS 1T
R_R_CM2       MID ESDN R_NOISELESS 1T
V_VCM_MAX     N2991623 VCC_B 100M
V_VCM_MIN     N2991635 VEE_B -100M
V_V_GRN       N2991943 MID -110
V_V_GRP       N2991901 MID 110
V_V_ISCN      N2991849 MID -80
V_V_ISCP      N2991807 MID 80
V_V_ORN       N2992295 VCLP -2.51
V_V_ORP       N2992331 VCLP 2.51
X_H1          N2992235 OUT N2992151 MID BLOCK_DC_H1_OPAx350
X_H2          N2992287 N2992323 V12 MID BLOCK_DC_H2_OPAx350
X_H3          N2992267 N2992299 V11 MID BLOCK_DC_H3_OPAx350
X_S1          N2992267 CLAMP N2992267 CLAMP BLOCK_DC_S1_OPAx350
X_S2          CLAMP N2992287 CLAMP N2992287 BLOCK_DC_S2_OPAx350
X_U1          ESDP N2991573 VNSE_OPAx350 PARAMS: FLW=10 GLF=0.4405 RNV=29.6
X_U10         VCC_CLP VEE_CLP VOUT_S MID N2991729 N2991763 CLAMP_AMP_LO_OPAx350 PARAMS:
+  G=1
X_U11         N2991807 N2991849 VIMON MID N2991809 N2991837 CLAMP_AMP_LO_OPAx350
+  PARAMS: G=1
X_U12         N2991901 N2991943 N2991969 MID N2991905 N2991931 CLAMP_AMP_HI_OPAx350
+  PARAMS: G=10
X_U16         MID N2992105 N2992093 N2992099 OL_SENSE_OPAx350
X_U18         VIMON MID N2991997 VCC_B CLAWP_OPAx350
X_U19         MID VIMON VEE_B N2992001 CLAWN_OPAx350
X_U21         OUT VCC VEE ESD_OUT_OPAx350
X_U22         N2991811 N2991831 CL_CLAMP MID CL_SRC_OPAx350 PARAMS: GAIN=1 IPOS=0.44E1
+  INEG=-0.44E1
X_U23         N2991907 N2991925 CLAMP MID GR_SRC_OPAx350 PARAMS: GAIN=1 IPOS=0.45E1
+  INEG=-0.45E1
X_U25         SW_OL_OPAx350 MID N3294626 N3294630 SW_OL_OPAx350
X_U26         VIMON MID VCC MID IQ_SRC_OPAx350 PARAMS: GAIN=1E-3
X_U27         MID VIMON MID VEE IQ_SRC_OPAx350 PARAMS: GAIN=1E-3
X_U30         N2991657 N2991619 MID N2991667 AOL_1_OPAx350 PARAMS: GAIN=1E-4 IPOS=.5
+  INEG=-.5
X_U31         N2991667 MID MID CLAMP AOL_2_OPAx350 PARAMS: GAIN=0.024669 IPOS=0.22888
+  INEG=-0.22816
X_U32         N3828449 MID MID N3294682 ZO_SRC_OPAx350 PARAMS: GAIN=7910.2075
+  IPOS=10.4E5 INEG=-10.4E5
X_U35         N2991741 N2991765 CLAW_CLAMP MID CLAW_SRC_OPAx350 PARAMS: GAIN=1
+  IPOS=0.22E1 INEG=-0.22E1
X_U36         N2991573 MID FEMT_OPAx350 PARAMS: NVRF=0.5
X_U37         ESDN MID FEMT_OPAx350 PARAMS: NVRF=0.5
X_U4          N2991555 N2991573 VOS_DRIFT_OPAx350 PARAMS: DC=-9.5679E-05 POL=1 DRIFT=4E-6
X_U5          ESDN ESDP VCC VEE ESD_IN_OPAx350
X_U6          N2991587 MID N2991643 MID N2991623 N2991635 VCM_CLAMP_OPAx350 PARAMS:
+  GAIN=1
.MODEL R_NOISELESS RES (T_ABS=-273.15)
.ENDS OPAx350
*
.SUBCKT BLOCK_DC_H1_OPAx350 1 2 3 4
H_H1         3 4 VH_H1 1K
VH_H1         1 2 0V
.ENDS  BLOCK_DC_H1_OPAx350
*
.SUBCKT BLOCK_DC_H2_OPAx350 1 2 3 4
H_H2         3 4 VH_H2 1
VH_H2         1 2 0V
.ENDS  BLOCK_DC_H2_OPAx350
*
.SUBCKT BLOCK_DC_H3_OPAx350 1 2 3 4
H_H3         3 4 VH_H3 -1
VH_H3         1 2 0V
.ENDS  BLOCK_DC_H3_OPAx350
*
.SUBCKT BLOCK_DC_S1_OPAx350 1 2 3 4
S_S1         3 4 1 2 _S1
RS_S1         1 2 1G
.MODEL         _S1 VSWITCH ROFF=1E12 RON=10M VOFF=0.0V VON=10MV
.ENDS  BLOCK_DC_S1_OPAx350
*
.SUBCKT BLOCK_DC_S2_OPAx350 1 2 3 4
S_S2         3 4 1 2 _S2
RS_S2         1 2 1G
.MODEL         _S2 VSWITCH ROFF=1E12 RON=10M VOFF=0.0V VON=10MV
.ENDS  BLOCK_DC_S2_OPAx350
*
.SUBCKT AOL_1_OPAx350 VC+ VC- IOUT+ IOUT- PARAMS: GAIN=1E-4 IPOS=.5 INEG=-.5
G1 IOUT+ IOUT- VALUE={LIMIT(GAIN*V(VC+,VC-),INEG,IPOS)}
.ENDS  AOL_1_OPAx350
*
.SUBCKT AOL_2_OPAx350 VC+ VC- IOUT+ IOUT- PARAMS: GAIN=0.024669 IPOS=0.22888 INEG=-0.22816
G1 IOUT+ IOUT- VALUE={LIMIT(GAIN*V(VC+,VC-),INEG,IPOS)}
.ENDS  AOL_2_OPAx350
*
.SUBCKT CLAMP_AMP_HI_OPAx350 VC+ VC- VIN COM VO+ VO- PARAMS: G=10
GVO+ COM VO+ VALUE = {IF(V(VIN,COM)>V(VC+,COM),((V(VIN,COM)-V(VC+,COM))*G),0)}
GVO- COM VO- VALUE = {IF(V(VIN,COM)<V(VC-,COM),((V(VC-,COM)-V(VIN,COM))*G),0)}
.ENDS  CLAMP_AMP_HI_OPAx350
*
.SUBCKT CLAMP_AMP_LO_OPAx350 VC+ VC- VIN COM VO+ VO- PARAMS: G=1
GVO+ COM VO+ VALUE = {IF(V(VIN,COM)>V(VC+,COM),((V(VIN,COM)-V(VC+,COM))*G),0)}
GVO- COM VO- VALUE = {IF(V(VIN,COM)<V(VC-,COM),((V(VC-,COM)-V(VIN,COM))*G),0)}
.ENDS  CLAMP_AMP_LO_OPAx350
*
.SUBCKT CLAWN_OPAx350 VC+ VC- IOUT+ IOUT-
G1 IOUT+ IOUT- TABLE {(V(VC+,VC-))} =
+(0,         12.11E-6)
+(26.6667, 0.00019845)
+(53.3333, 0.00047142)
+(71.1111, 0.00065784)
+(72,      0.00066716)
+(73.7778,  0.0006858)
+(75.5556, 0.00070444)
+(77.3333, 0.00072309)
+(79.1111, 0.00074173)
+(80,         0.00275)
.ENDS  CLAWN_OPAx350
*
.SUBCKT CLAWP_OPAx350 VC+ VC- IOUT+ IOUT-
G1 IOUT+ IOUT- TABLE {(V(VC+,VC-))} =
+(0,         12.09E-6)
+(26.6667,  0.0002474)
+(53.3333, 0.00029078)
+(71.1111,  0.0003197)
+(72,      0.00032115)
+(73.7778, 0.00032404)
+(75.5556, 0.00032693)
+(77.3333, 0.00032982)
+(79.1111, 0.00033272)
+(80,         0.00275)
.ENDS  CLAWP_OPAx350
*
.SUBCKT CLAW_SRC_OPAx350 VC+ VC- IOUT+ IOUT- PARAMS: GAIN=1 IPOS=0.22E1 INEG=-0.22E1
G1 IOUT+ IOUT- VALUE={LIMIT(GAIN*V(VC+,VC-),INEG,IPOS)}
.ENDS  CLAW_SRC_OPAx350
*
.SUBCKT CL_SRC_OPAx350 VC+ VC- IOUT+ IOUT- PARAMS: GAIN=1 IPOS=0.44E1 INEG=-0.44E1
G1 IOUT+ IOUT- VALUE={LIMIT(GAIN*V(VC+,VC-),INEG,IPOS)}
.ENDS  CL_SRC_OPAx350
*
.SUBCKT ESD_IN_OPAx350 ESDN ESDP VCC VEE
.MODEL ESD_SW VSWITCH(RON=50 ROFF=1E12 VON=500E-3 VOFF=450E-3)
S1 ESDN VCC ESDN VCC ESD_SW
S2 ESDP VCC ESDP VCC ESD_SW
S3 VEE ESDN VEE ESDN ESD_SW
S4 VEE ESDP VEE ESDP ESD_SW
.ENDS  ESD_IN_OPAx350
*
.SUBCKT ESD_OUT_OPAx350 OUT VCC VEE
.MODEL ESD_SW VSWITCH(RON=50 ROFF=1E12 VON=500E-3 VOFF=450E-3)
S1 OUT VCC OUT VCC ESD_SW
S2 VEE OUT VEE OUT ESD_SW
.ENDS  ESD_OUT_OPAx350
*
.SUBCKT FEMT_OPAx350 1 2 PARAMS: NVRF=0.5
E1 3 0 5 0 10
R1 5 0 {1.184*PWR(NVRF,2)}
R2 5 0 {1.184*PWR(NVRF,2)}
G1 1 2 3 0 1E-6
.ENDS  FEMT_OPAx350
*
.SUBCKT GR_SRC_OPAx350 VC+ VC- IOUT+ IOUT- PARAMS: GAIN=1 IPOS=0.45E1 INEG=-0.45E1
G1 IOUT+ IOUT- VALUE={LIMIT(GAIN*V(VC+,VC-),INEG,IPOS)}
.ENDS  GR_SRC_OPAx350
*
.SUBCKT IQ_SRC_OPAx350 VC+ VC- IOUT+ IOUT- PARAMS: GAIN=1E-3
G1 IOUT+ IOUT- VALUE={IF( (V(VC+,VC-)<=0),0,GAIN*V(VC+,VC-) )}
.ENDS  IQ_SRC_OPAx350
*
.SUBCKT OL_SENSE_OPAx350 COM SW+ OLN OLP
GSW+ COM SW+ VALUE = {IF((V(OLN,COM)>10E-3 | V(OLP,COM)>10E-3),1,0)}
.ENDS  OL_SENSE_OPAx350
*
.SUBCKT SW_OL_OPAx350 SW_OL_OPAx350 MID CAP_L CAP_R
.MODEL OL_SW VSWITCH(RON=1E-3 ROFF=1E12 VON=900E-3 VOFF=800E-3)
S1 CAP_L CAP_R SW_OL_OPAx350 MID OL_SW
.ENDS  SW_OL_OPAx350
*
.SUBCKT VCM_CLAMP_OPAx350 VIN+ VIN- IOUT- IOUT+ VP+ VP- PARAMS: GAIN=1
G1 IOUT+ IOUT- VALUE={LIMIT(GAIN*V(VIN+,VIN-),V(VP-,VIN-), V(VP+,VIN-))}
.ENDS  VCM_CLAMP_OPAx350
*
.SUBCKT VNSE_OPAx350 1 2 PARAMS: FLW=10 GLF=0.4405 RNV=29.6
.MODEL DVN D KF={PWR(FLW,0.5)/1E11} IS=1.0E-16
I1 0 7 10E-3
I2 0 8 10E-3
D1 7 0 DVN
D2 8 0 DVN
E1 3 6 7 8 {GLF}
R1 3 0 1E9
R2 3 0 1E9
R3 3 6 1E9
E2 6 4 5 0 10
R4 5 0 {RNV}
R5 5 0 {RNV}
R6 3 4 1E9
R7 4 0 1E9
E3 1 2 3 4 1
.ENDS  VNSE_OPAx350
*
.SUBCKT VOS_DRIFT_OPAx350 VOS+ VOS- PARAMS: DC=-9.5679E-05 POL=1 DRIFT=4E-6
E1 VOS+ VOS- VALUE={DC+POL*DRIFT*(TEMP-27)}
.ENDS  VOS_DRIFT_OPAx350
*
.SUBCKT ZO_SRC_OPAx350 VC+ VC- IOUT+ IOUT- PARAMS: GAIN=7910.2075 IPOS=10.4E5 INEG=-10.4E5
G1 IOUT+ IOUT- VALUE={LIMIT(GAIN*V(VC+,VC-),INEG,IPOS)}
.ENDS  ZO_SRC_OPAx350
*
.ac dec 250 .1 100k
* Bass Channel
* 2-Pole Low Pass Filter
* Variable Gain:
* Cut-off Frequency : 300 Hz
* Ra
* Rb
* Gain :
* Av = 1 + (Ra / Rb)
* Av = 1 + (10k / 20k) = 1.5 (Linear)
* Treble Channel
* 2-Pole Low Pass Filter
* Variable Gain:
* Cut-off Frequency : 300 Hz
* Ra
* Rb
* Mid Channel
.backanno
.end